# EAGLE design button_pcb_v1 (EAGLE 9.2.2)
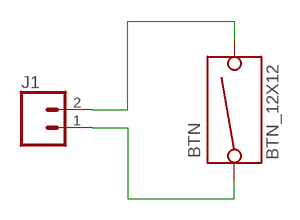
[diagram p0: schematic, sheet 1]

## Parts
BTN  BTN_12X12  [BTN_12X12]
J1  CONN_021X02_NO_SILK  [1X02_NO_SILK]

## Nets
N$1: BTN.2 BTN.3 J1.2
N$2: BTN.1 BTN.4 J1.1

## Library data of the parts
BTN = AES_lib:BTN_12X12
J1 = SparkFun-Connectors:CONN_02: Multi connection point. Often used as Generic Header-pin footprint for 0.1 inch spaced/style header connections On any of the 0.1 inch spaced packages, you can populate with these: Break Away Headers - Straight <https://www.sparkfun.com/products/116> (PRT-00116) Break Away Male Headers - Right Angle <https://www.sparkfun.com/products/553> (PRT-00553) Female Headers <https://www.sparkfun.com/products/115> (PRT-00115) Break Away Headers - Machine Pin <https://www.sparkfun.com/products/117> (PRT-00117) Break Away Female Headers - Swiss Machine Pin <https://www.sparkfun.com/products/743> (PRT-00743) For SCREWTERMINALS and SPRING TERMINALS visit here: Screw Terimnals on SparkFun.com <https://www.sparkfun.com/search/results?term=Screw+Terminals> (5mm/3.5mm/2.54mm spacing) This device is also useful as a general connection point to wire up your design to another part of your project. Our various solder wires solder well into these plated through hole pads. Hook-Up Wire - Assortment (Stranded, 22 AWG) <https://www.sparkfun.com/products/11375> (PRT-11375) Hook-Up Wire - Assortment (Solid Core, 22 AWG) <https://www.sparkfun.com/products/11367> (PRT-11367) View the entire wire category on our website here <https://www.sparkfun.com/categories/141> Special notes: Molex polarized connector foot print use with: PRT-08233 with associated crimp pins and housings. 2.54_SCREWTERM for use with PRT-10571. 3.5mm Screw Terminal footprints for PRT-08084 5mm Screw Terminal footprints for use with PRT-08432

## Board
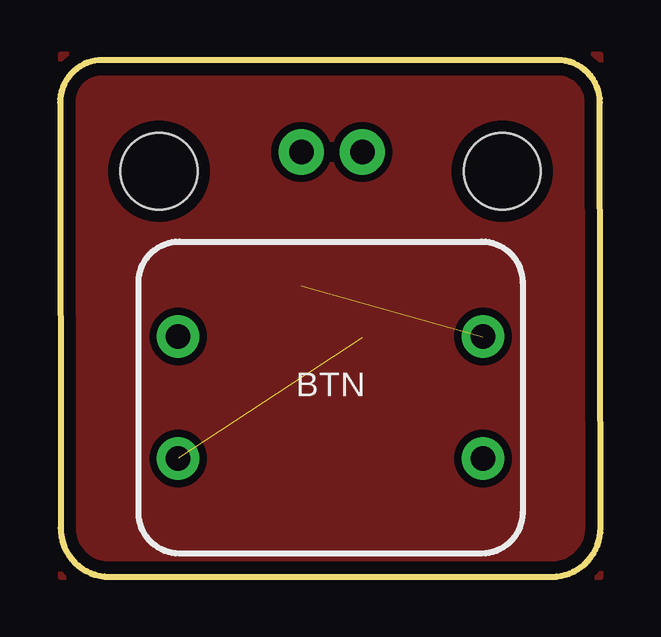
[diagram p1: board, top side]
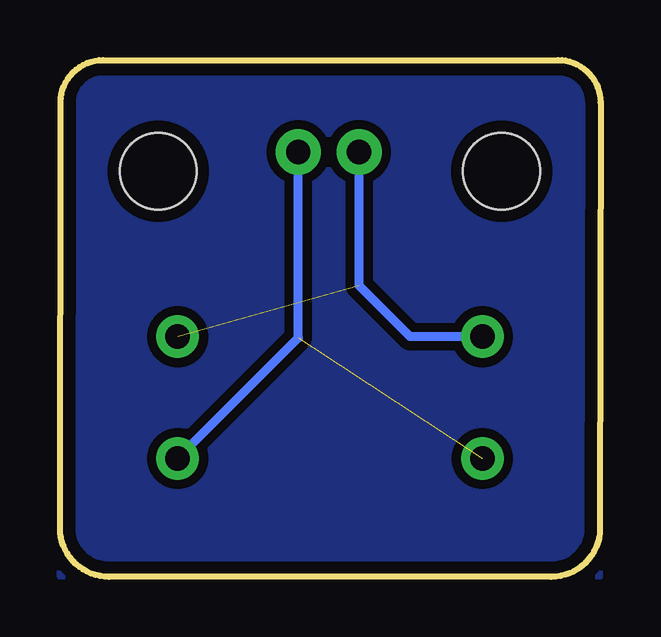
[diagram p2: board, bottom side, seen from below]

Size 22.52 x 21.53 mm. Coordinates in mm from the lower left corner, seen from the top.
Outline: 22.52,2.04 22.5,19.76 arc90 20.72,21.53 1.78,21.53 arc90 0,19.75 0.02,2.03 arc90 2.06,0 20.49,0 arc90 22.52,2.04
Copper layers (1*16): Top 0.035mm / dielectric 1.5mm / Bottom 0.035mm
Design rules "default *": minimum track width 6mil, minimum drill 0.35mm, track to track 8mil, track to pad 8mil, pad to pad 8mil, via to via 8mil, smd to smd 6mil, copper to edge 20mil, drill to drill 10mil, minimum pad ring 10mil, minimum via ring 8mil, stop-mask expansion 4mil, vias tented up to drill 0mil, thermal gap 10mil
Holes 3.2 mm at 4.12,16.9 18.42,16.9

### Footprints (pad centres in the part's own frame; a part is rotated, then mirrored left to right if it is on the bottom)
BTN_12X12 = drill 1.016 pad 1.778: 1 -6.35,2.54; 2 -6.35,-2.54; 3 6.35,-2.54; 4 6.35,2.54
1X02_NO_SILK = drill 1.016 pad 1.88: 1 0,0; 2 2.54,0

### Placement (x,y rotation side)
BTN  11.27,7.47 0 top
J1  10.06,17.7 0 top

### Tracks (layer width: path | path; a pad name or v marks a point on that pad's centre or on a via)
GND
  pour Top (isolate 0.381): 22.52,21.76 0.02,21.76 0.02,0 22.52,0
  pour Top (isolate 0.305): 0,21.53 0.03,0 22.53,0 22.5,21.53
N$1  (via drill 0.35)  (1 unrouted)
  Top 0.381: J1.2
  Bottom 0.381: BTN.3 12.59,9.96 J1.2
  other vias: 12.59,17.7
N$2  (1 unrouted)
  Bottom 0.381: BTN.1 7.94,10.01 10.06,12.13 J1.1
N$4
  pour Bottom (isolate 0.381): 0,21.53 0.03,0 22.53,0 22.5,21.53